# Altium schematic sheet Pallette v1.SchDoc
size A3
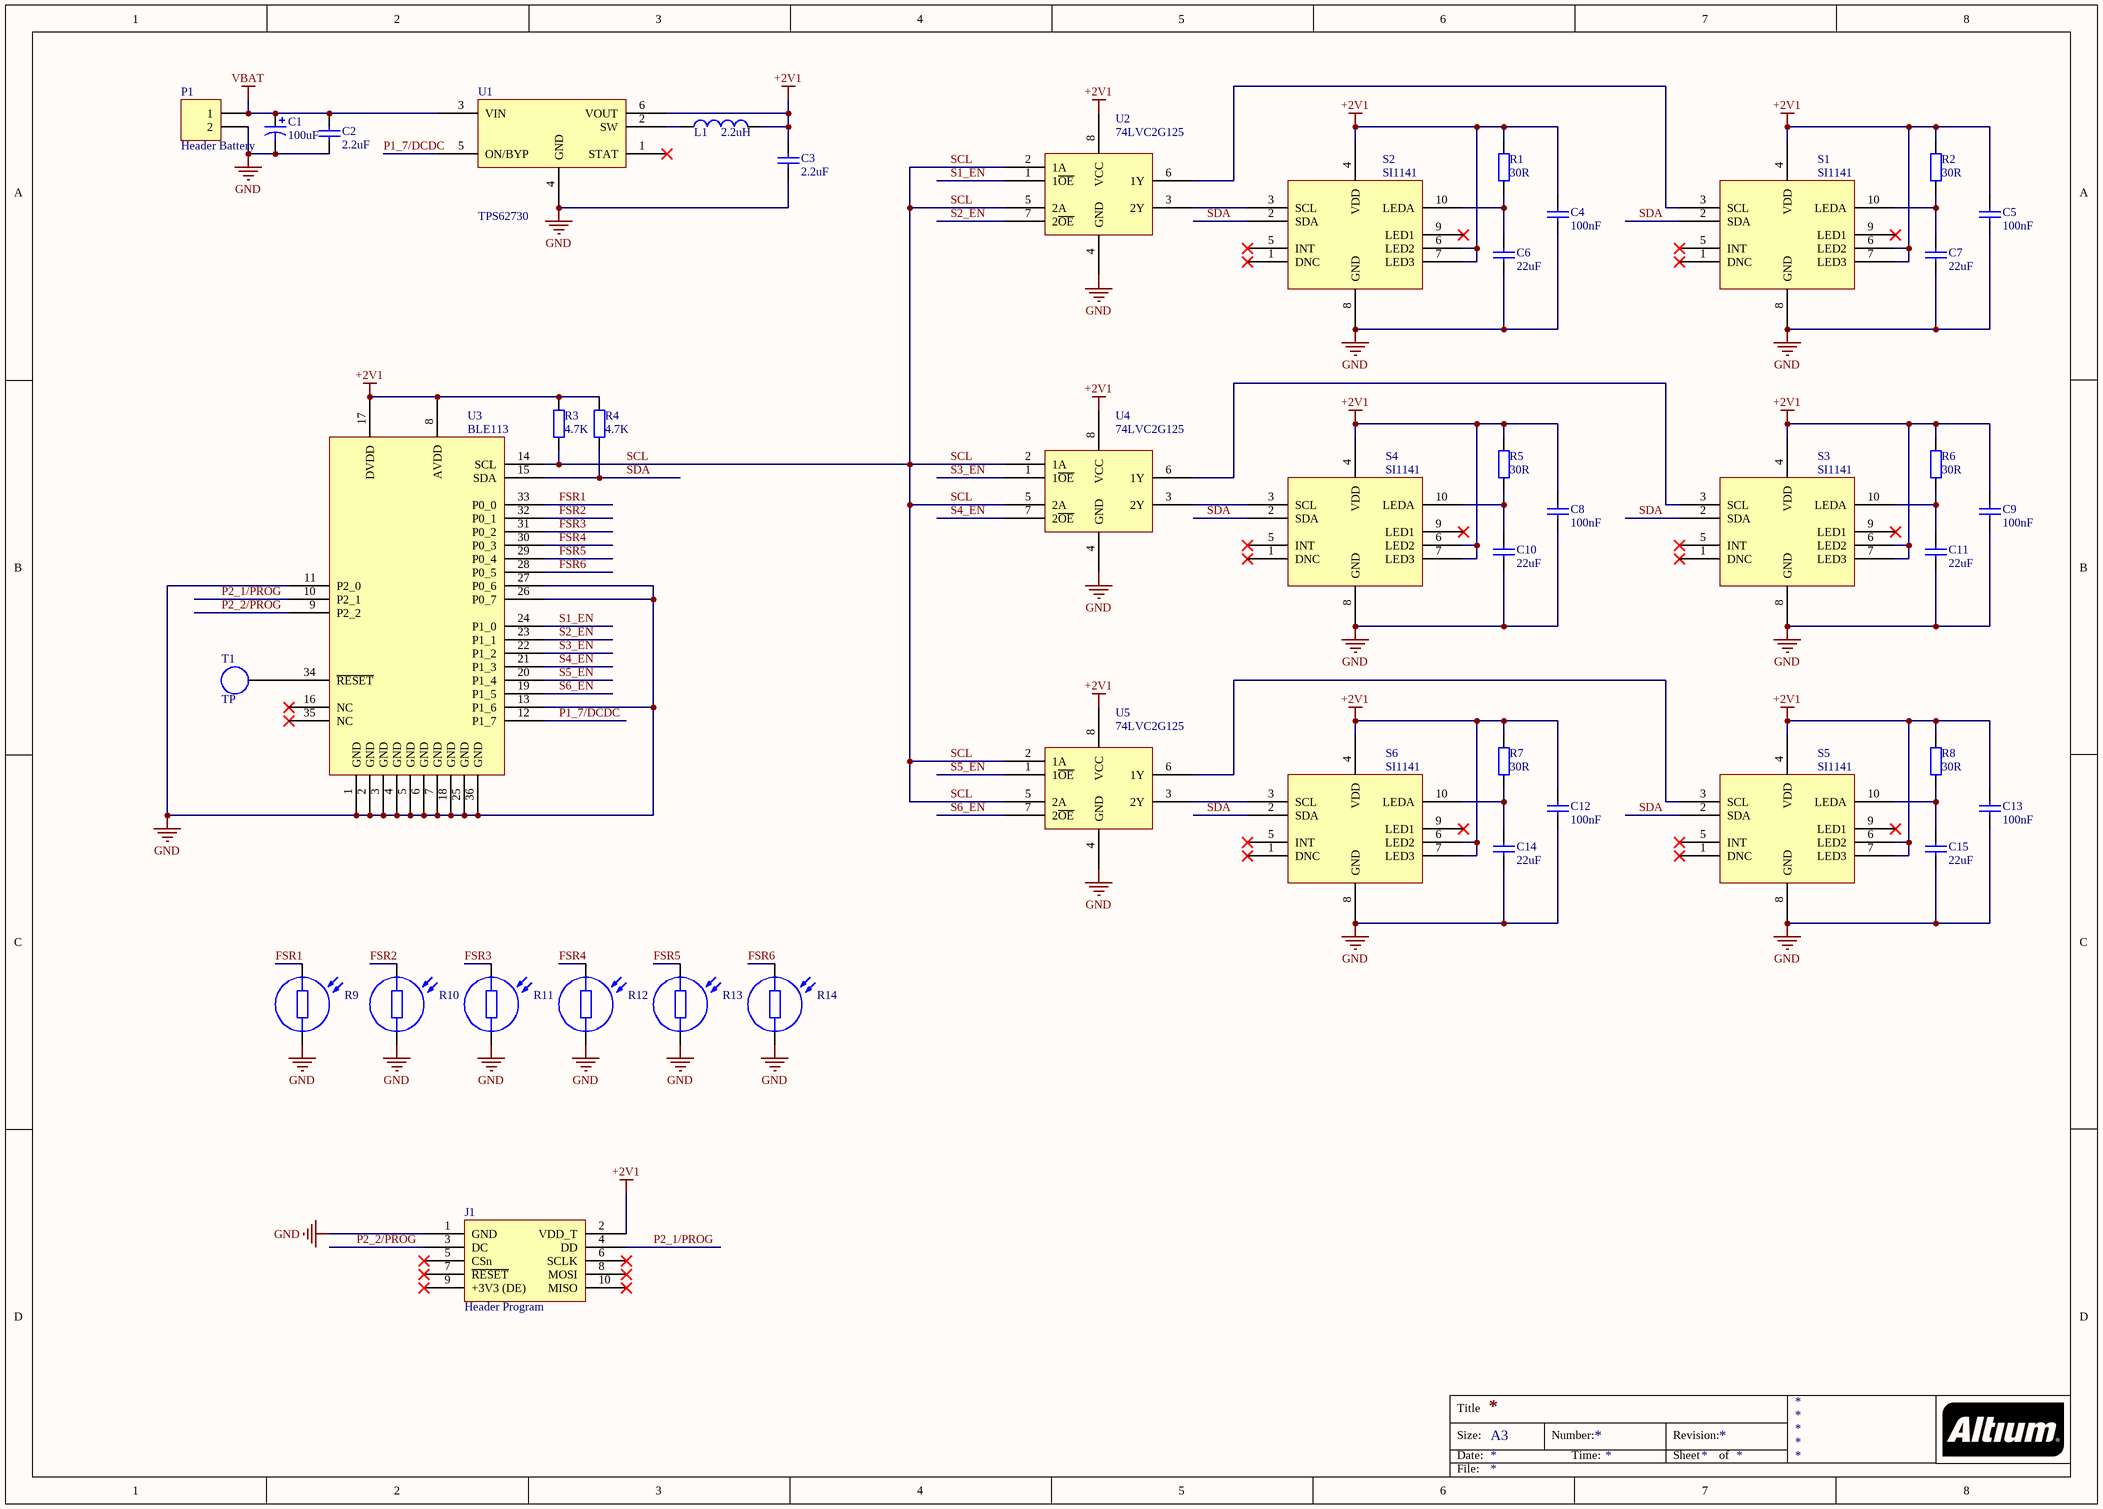
[diagram p0: Pallette v1.SchDoc]

## Parts
C1  value 100uF  [1411]  (hidden comment: Cap Pol 100uF)
C2  value 2.2uF  [0402]  (hidden comment: Cap 2.2uF)
C3  value 2.2uF  [0402]  (hidden comment: Cap 2.2uF)
C4  value 100nF  [0402]  (hidden comment: Cap 100nF)
C5  value 100nF  [0402]  (hidden comment: Cap 100nF)
C6  value 22uF  [0603]  (hidden comment: Cap 22uF)
C7  value 22uF  [0603]  (hidden comment: Cap 22uF)
C8  value 100nF  [0402]  (hidden comment: Cap 100nF)
C9  value 100nF  [0402]  (hidden comment: Cap 100nF)
C10  value 22uF  [0603]  (hidden comment: Cap 22uF)
C11  value 22uF  [0603]  (hidden comment: Cap 22uF)
C12  value 100nF  [0402]  (hidden comment: Cap 100nF)
C13  value 100nF  [0402]  (hidden comment: Cap 100nF)
C14  value 22uF  [0603]  (hidden comment: Cap 22uF)
C15  value 22uF  [0603]  (hidden comment: Cap 22uF)
J1  Header Program  [TC2050-IDC-NL]
L1  value 2.2uH  [0805]  (hidden comment: Ind 2.2uH)
P1  Header Battery  [Battery Leads]
R1  value 30R  [0402]  (hidden comment: Res 30R)
R2  value 30R  [0402]  (hidden comment: Res 30R)
R3  value 4.7K  [0402]  (hidden comment: Res 4.7K)
R4  value 4.7K  [0402]  (hidden comment: Res 4.7K)
R5  value 30R  [0402]  (hidden comment: Res 30R)
R6  value 30R  [0402]  (hidden comment: Res 30R)
R7  value 30R  [0402]  (hidden comment: Res 30R)
R8  value 30R  [0402]  (hidden comment: Res 30R)
R9  FSR 400 Short  [FSR 400 Short]  (value not drawn)
R10  FSR 400 Short  [FSR 400 Short]  (value not drawn)
R11  FSR 400 Short  [FSR 400 Short]  (value not drawn)
R12  FSR 400 Short  [FSR 400 Short]  (value not drawn)
R13  FSR 400 Short  [FSR 400 Short]  (value not drawn)
R14  FSR 400 Short  [FSR 400 Short]  (value not drawn)
S1  value SI1141  [SI1141-M01]  (hidden comment: Si1141-M01)
S2  value SI1141  [SI1141-M01]  (hidden comment: Si1141-M01)
S3  value SI1141  [SI1141-M01]  (hidden comment: Si1141-M01)
S4  value SI1141  [SI1141-M01]  (hidden comment: Si1141-M01)
S5  value SI1141  [SI1141-M01]  (hidden comment: Si1141-M01)
S6  value SI1141  [SI1141-M01]  (hidden comment: Si1141-M01)
T1  TP  [TP]
U1  TPS62730  [6-UFDFN]
U2  74LVC2G125  [VSSOP8]
U3  BLE113  [BLE113-A]
U4  74LVC2G125  [VSSOP8]
U5  74LVC2G125  [VSSOP8]

## Nets
+2V1: C3.2 C4.2 C5.2 C8.2 C9.2 C12.2 C13.2 J1.2(VDD_T) L1.2 R1.2 R2.2 R3.2 R4.2 R5.2 R6.2 R7.2 R8.2 S1.4(VDD) S1.6(LED2) S1.7(LED3) S2.4(VDD) S2.6(LED2) S2.7(LED3) S3.4(VDD) S3.6(LED2) S3.7(LED3) S4.4(VDD) S4.6(LED2) S4.7(LED3) S5.4(VDD) S5.6(LED2) S5.7(LED3) S6.4(VDD) S6.6(LED2) S6.7(LED3) U1.6(VOUT) U2.8(VCC) U3.8(AVDD) U3.17(DVDD) U4.8(VCC) U5.8(VCC)
GND: C1.2 C2.1 C3.1 C4.1 C5.1 C6.1 C7.1 C8.1 C9.1 C10.1 C11.1 C12.1 C13.1 C14.1 C15.1 J1.1(GND) P1.2 R9.1 R10.1 R11.1 R12.1 R13.1 R14.1 S1.8(GND) S2.8(GND) S3.8(GND) S4.8(GND) S5.8(GND) S6.8(GND) U1.4(GND) U2.4(GND) U3.1(GND) U3.2(GND) U3.3(GND) U3.4(GND) U3.5(GND) U3.6(GND) U3.7(GND) U3.11(P2_0) U3.13(P1_6) U3.18(GND) U3.25(GND) U3.26(P0_7) U3.27(P0_6) U3.36(GND) U4.4(GND) U5.4(GND)
VBAT: C1.1 C2.2 P1.1 U1.3(VIN)
FSR1: R9.2 U3.33(P0_0)
FSR2: R10.2 U3.32(P0_1)
FSR3: R11.2 U3.31(P0_2)
FSR4: R12.2 U3.30(P0_3)
FSR5: R13.2 U3.29(P0_4)
FSR6: R14.2 U3.28(P0_5)
P1_7/DCDC: U1.5(ON/BYP) U3.12(P1_7)
P2_1/PROG: J1.4(DD) U3.10(P2_1)
P2_2/PROG: J1.3(DC) U3.9(P2_2)
S1_EN: U2.1(1~{OE}) U3.24(P1_0)
S2_EN: U2.7(2~{OE}) U3.23(P1_1)
S3_EN: U3.22(P1_2) U4.1(1~{OE})
S4_EN: U3.21(P1_3) U4.7(2~{OE})
S5_EN: U3.20(P1_4) U5.1(1~{OE})
S6_EN: U3.19(P1_5) U5.7(2~{OE})
SCL: R3.1 U2.2(1A) U2.5(2A) U3.14(SCL) U4.2(1A) U4.5(2A) U5.2(1A) U5.5(2A)
SDA: R4.1 S1.2(SDA) S2.2(SDA) S3.2(SDA) S4.2(SDA) S5.2(SDA) S6.2(SDA) U3.15(SDA)
NetC6_2: C6.2 R1.1 S2.10(LEDA)
NetC7_2: C7.2 R2.1 S1.10(LEDA)
NetC10_2: C10.2 R5.1 S4.10(LEDA)
NetC11_2: C11.2 R6.1 S3.10(LEDA)
NetC14_2: C14.2 R7.1 S6.10(LEDA)
NetC15_2: C15.2 R8.1 S5.10(LEDA)
NetL1_1: L1.1 U1.2(SW)
NetS1_3: S1.3(SCL) U2.6(1Y)
NetS2_3: S2.3(SCL) U2.3(2Y)
NetS3_3: S3.3(SCL) U4.6(1Y)
NetS4_3: S4.3(SCL) U4.3(2Y)
NetS5_3: S5.3(SCL) U5.6(1Y)
NetS6_3: S6.3(SCL) U5.3(2Y)
NetT1_?1: T1.?1 U3.34(~{RESET})

Not connected (* = marked no-connect by the designer): J1 5(CSn)* 6(SCLK)* 7(~{RESET})* 8(MOSI)* 9(+3V3_(DE))* 10(MISO)*; S1 1(DNC)* 5(INT)* 9(LED1)*; S2 1(DNC)* 5(INT)* 9(LED1)*; S3 1(DNC)* 5(INT)* 9(LED1)*; S4 1(DNC)* 5(INT)* 9(LED1)*; S5 1(DNC)* 5(INT)* 9(LED1)*; S6 1(DNC)* 5(INT)* 9(LED1)*; U1 1(STAT)*; U3 16(NC)* 35(NC)*

## Notes on the sheet
- Title
- Size:
- Date:
- A3
- Number:
- Time:
- Revision:
- Sheet
- of
- File:

## Library data of the parts
C1 = Cap Pol 100uF: 100uF Polarized Capacitor; Published: 8-Jun-2000; LatestRevisionDate: 17-Jul-2002; LatestRevisionNote: Re-released for DXP Platform.; PackageReference: POLAR0.8; Publisher: Altium Limited; PackageDescription: Polarized Capacitor; 2 Leads
C2 C3 = Cap 2.2uF: 2.2uF Capacitor; Published: 8-Jun-2000; LatestRevisionDate: 17-Jul-2002; LatestRevisionNote: Re-released for DXP Platform.; PackageReference: RAD-0.3; Publisher: Altium Limited; PackageDescription: Radial Cap, Thru-Hole; 2 Leads; 0.3 in Pin Spacing
C4 C5 C8 C9 C12 C13 = Cap 100nF: 100nF Capacitor; Published: 8-Jun-2000; LatestRevisionDate: 17-Jul-2002; LatestRevisionNote: Re-released for DXP Platform.; PackageReference: RAD-0.3; Publisher: Altium Limited; PackageDescription: Radial Cap, Thru-Hole; 2 Leads; 0.3 in Pin Spacing
C6 C7 C10 C11 C14 C15 = Cap 22uF: 22uF Capacitor; Published: 8-Jun-2000; LatestRevisionDate: 17-Jul-2002; LatestRevisionNote: Re-released for DXP Platform.; PackageReference: RAD-0.3; Publisher: Altium Limited; PackageDescription: Radial Cap, Thru-Hole; 2 Leads; 0.3 in Pin Spacing
J1 = Header Program: CCDebugger Programming Header
L1 = Ind 2.2uH: 2.2uH Inductor; Code_IEC: 1005; Published: 8-Jun-2000; LatestRevisionDate: 29-May-2009; LatestRevisionNote: IPC-7351 Footprint Added.; PackageReference: 0402-A; Publisher: Altium Limited; PackageDescription: Chip Inductor; Code_JEITA: 0402
P1 = Header Battery: Battery Leads; LatestRevisionDate: 17-Jul-2002; LatestRevisionNote: Re-released for DXP Platform.; Publisher: Altium Limited
R1 R2 R5-R8 = Res 30R: 30R Resistor; Published: 8-Jun-2000; LatestRevisionDate: 17-Jul-2002; LatestRevisionNote: Re-released for DXP Platform.; PackageReference: AXIAL-0.4; Publisher: Altium Limited; PackageDescription: Axial Device, Thru-Hole; 2 Leads; 0.4 in Pin Spacing
R3 R4 = Res 4.7K: 4.7K Resistor; Published: 8-Jun-2000; LatestRevisionDate: 17-Jul-2002; LatestRevisionNote: Re-released for DXP Platform.; PackageReference: AXIAL-0.4; Publisher: Altium Limited; PackageDescription: Axial Device, Thru-Hole; 2 Leads; 0.4 in Pin Spacing
R9-R14 = FSR 400 Short: FSR 400 Short Force sensing resistor; Published: 8-Jun-2000; LatestRevisionDate: 17-Jul-2002; LatestRevisionNote: Re-released for DXP Platform.; PackageReference: AXIAL-0.4; Publisher: Altium Limited; PackageDescription: Axial Device, Thru-Hole; 2 Leads; 0.4 in Pin Spacing
S1-S6 = Si1141-M01: Si1141-M01 IR Light Sensor
T1 = TP: Test point
U1 = TPS62730: TPS62730 2.1V Step-Down Converter; Value: TPS62730
U2 U4 U5 = 74LVC2G125: 74LVC2G125 Dual bus buffer/line driver 3-state
U3 = BLE113: BLE113 Bluetooth Smart Module; Value: BLE113